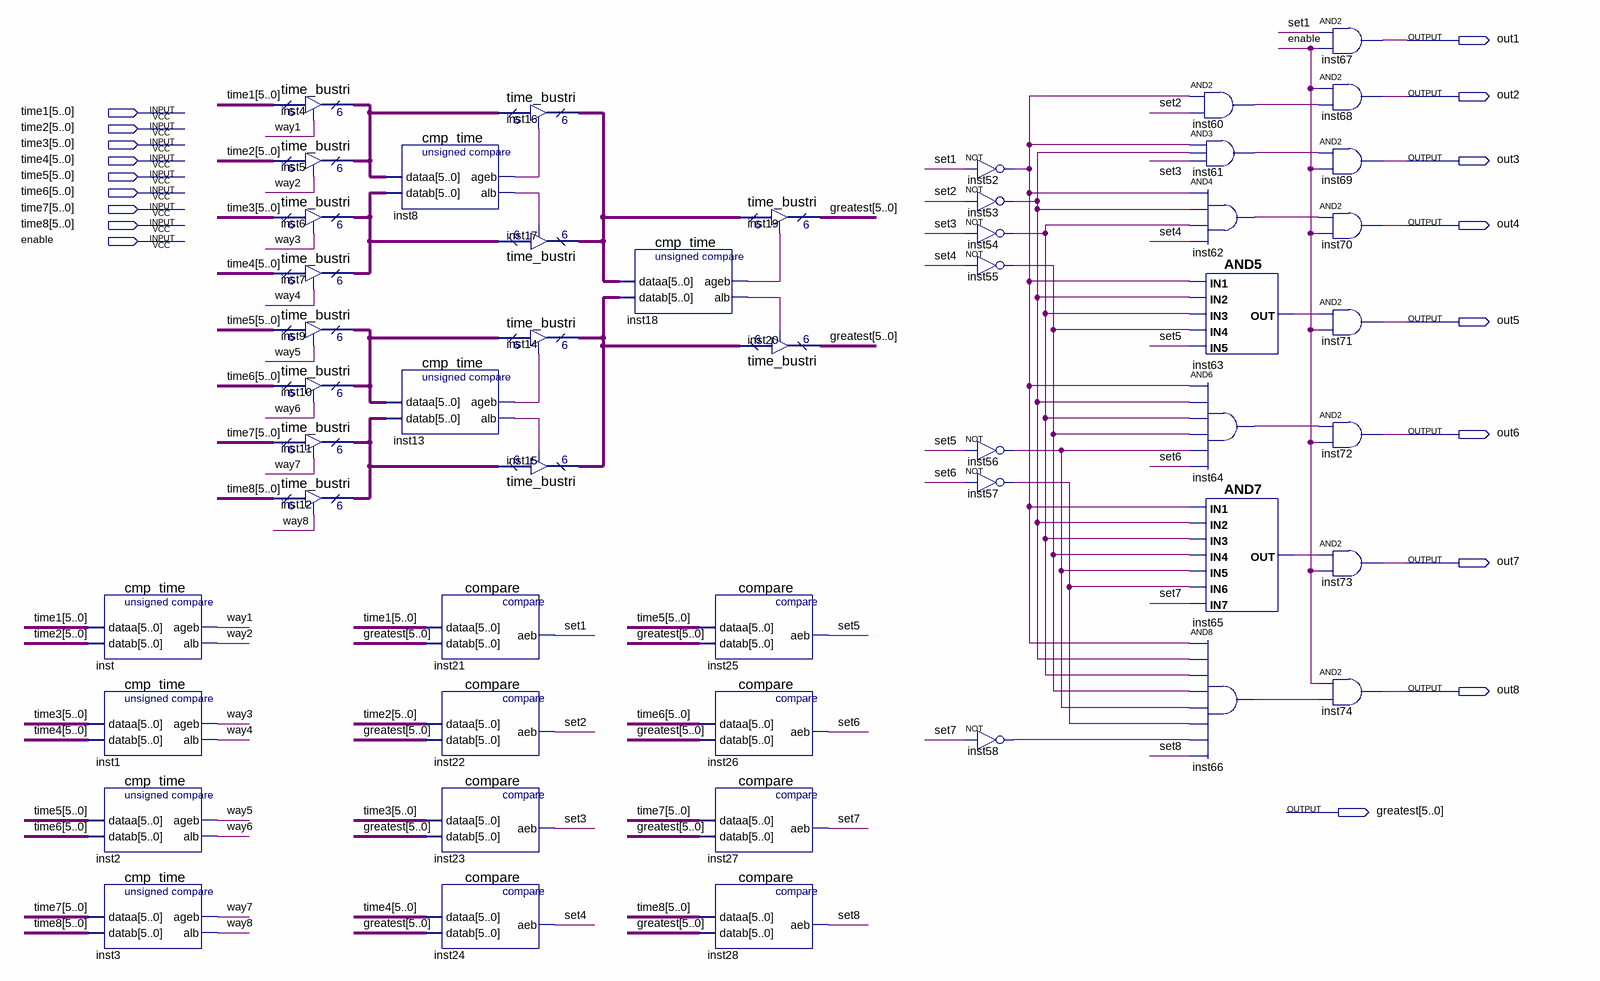
[diagram p0: schematic sheet]
// Quartus schematic find_greatest.bdf as structural Verilog: 51 symbols, 18 pins
module find_greatest (
  input  [5:0] time1,
  input  [5:0] time2,
  input  [5:0] time3,
  input  [5:0] time4,
  input  [5:0] time5,
  input  [5:0] time6,
  input  [5:0] time7,
  input  [5:0] time8,
  input  enable,
  output out1,
  output out2,
  output out3,
  output out4,
  output out5,
  output out6,
  output out7,
  output out8,
  output [5:0] greatest
);

  wire inst8_ageb, inst8_alb, inst13_ageb, inst13_alb, inst18_ageb, inst18_alb, inst52_out, inst53_out,
       inst54_out, inst55_out, inst56_out, inst57_out, inst58_out, inst60_out, inst61_out, inst62_out,
       inst63_out, inst64_out, inst65_out, inst66_out, set1, set2, set3, set4, set5, set6, set7, set8, way1,
       way2, way3, way4, way5, way6, way7, way8;
  wire [5:0] inst4_tridata, inst6_tridata, inst9_tridata, inst11_tridata, inst14_tridata, inst16_tridata;

  cmp_time inst (.dataa(time1), .datab(time2), .ageb(way1), .alb(way2));
  cmp_time inst1 (.dataa(time3), .datab(time4), .ageb(way3), .alb(way4));
  cmp_time inst2 (.dataa(time5), .datab(time6), .ageb(way5), .alb(way6));
  cmp_time inst3 (.dataa(time7), .datab(time8), .ageb(way7), .alb(way8));
  time_bustri inst4 (.enabledt(way1), .data(time1), .tridata(inst4_tridata));
  time_bustri inst5 (.enabledt(way2), .data(time2), .tridata(inst4_tridata));
  time_bustri inst6 (.enabledt(way3), .data(time3), .tridata(inst6_tridata));
  time_bustri inst7 (.enabledt(way4), .data(time4), .tridata(inst6_tridata));
  time_bustri inst9 (.enabledt(way5), .data(time5), .tridata(inst9_tridata));
  time_bustri inst10 (.enabledt(way6), .data(time6), .tridata(inst9_tridata));
  time_bustri inst11 (.enabledt(way7), .data(time7), .tridata(inst11_tridata));
  time_bustri inst12 (.enabledt(way8), .data(time8), .tridata(inst11_tridata));
  cmp_time inst8 (.dataa(inst4_tridata), .datab(inst6_tridata), .ageb(inst8_ageb), .alb(inst8_alb));
  cmp_time inst13 (.dataa(inst9_tridata), .datab(inst11_tridata), .ageb(inst13_ageb), .alb(inst13_alb));
  compare inst21 (.dataa(time1), .datab(greatest), .aeb(set1));
  compare inst22 (.dataa(time2), .datab(greatest), .aeb(set2));
  compare inst23 (.dataa(time3), .datab(greatest), .aeb(set3));
  compare inst24 (.dataa(time4), .datab(greatest), .aeb(set4));
  time_bustri inst16 (.enabledt(inst8_ageb), .data(inst4_tridata), .tridata(inst16_tridata));
  time_bustri inst17 (.enabledt(inst8_alb), .data(inst6_tridata), .tridata(inst16_tridata));
  time_bustri inst14 (.enabledt(inst13_ageb), .data(inst9_tridata), .tridata(inst14_tridata));
  time_bustri inst15 (.enabledt(inst13_alb), .data(inst11_tridata), .tridata(inst14_tridata));
  cmp_time inst18 (.dataa(inst16_tridata), .datab(inst14_tridata), .ageb(inst18_ageb), .alb(inst18_alb));
  compare inst25 (.dataa(time5), .datab(greatest), .aeb(set5));
  compare inst26 (.dataa(time6), .datab(greatest), .aeb(set6));
  compare inst27 (.dataa(time7), .datab(greatest), .aeb(set7));
  compare inst28 (.dataa(time8), .datab(greatest), .aeb(set8));
  time_bustri inst19 (.enabledt(inst18_ageb), .data(inst16_tridata), .tridata(greatest));
  time_bustri inst20 (.enabledt(inst18_alb), .data(inst14_tridata), .tridata(greatest));
  not inst52 (inst52_out, set1);
  not inst53 (inst53_out, set2);
  not inst54 (inst54_out, set3);
  not inst55 (inst55_out, set4);
  not inst56 (inst56_out, set5);
  not inst57 (inst57_out, set6);
  not inst58 (inst58_out, set7);
  and inst60 (inst60_out, inst52_out, set2);
  and inst61 (inst61_out, inst52_out, inst53_out, set3);
  and inst62 (inst62_out, inst52_out, inst53_out, inst54_out, set4);
  and inst63 (inst63_out, inst52_out, inst53_out, inst54_out, inst55_out, set5);
  and inst64 (inst64_out, inst52_out, inst53_out, inst54_out, inst55_out, inst56_out, set6);
  and inst65 (inst65_out, inst52_out, inst53_out, inst54_out, inst55_out, inst56_out, inst57_out, set7);
  and inst66 (inst66_out, inst52_out, inst53_out, inst54_out, inst55_out, inst56_out, inst57_out, inst58_out, set8);
  and inst67 (out1, set1, enable);
  and inst68 (out2, enable, inst60_out);
  and inst69 (out3, inst61_out, enable);
  and inst70 (out4, inst62_out, enable);
  and inst71 (out5, inst63_out, enable);
  and inst72 (out6, inst64_out, enable);
  and inst73 (out7, inst65_out, enable);
  and inst74 (out8, enable, inst66_out);
endmodule
